# Altium project 2015Capstone.PrjPcb
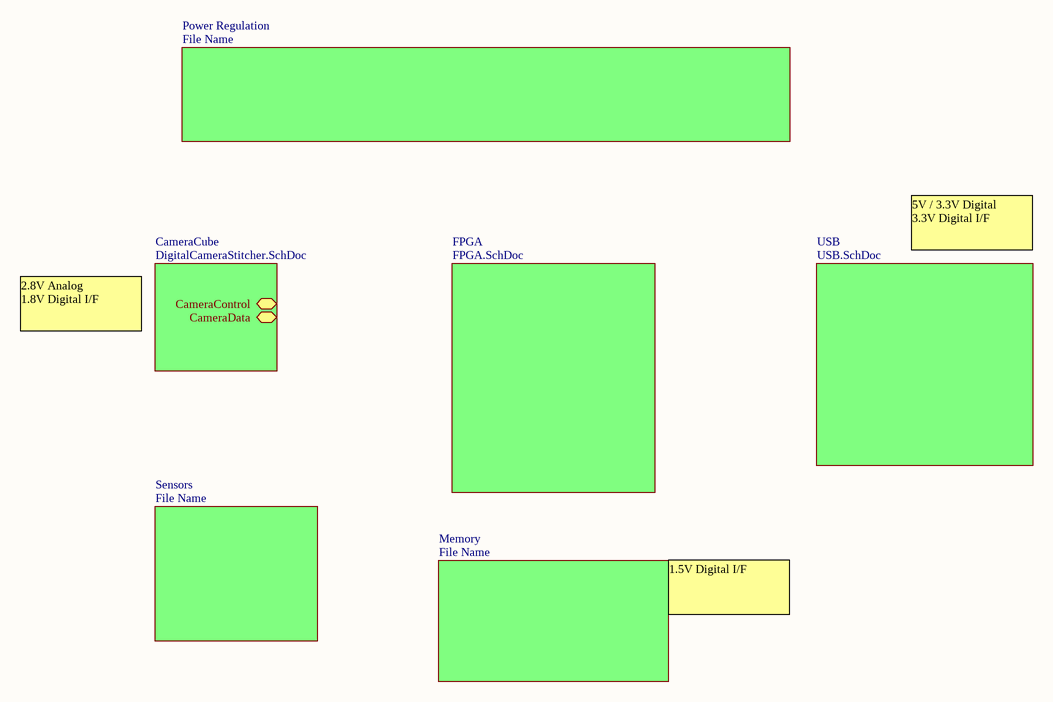
[diagram p0: Top.SchDoc]
7 sheets, 84 parts. Net scope: hierarchical (ports join the sheet entries above them; power ports are global).
Board file: DigitalCameraStitcher.PcbDoc
Sheets:
  Top.SchDoc
    FPGA = FPGA.SchDoc
      Power&Config = FPGA_Misc.SchDoc
      Bank 2 = FPGA_Bank2.SchDoc
      Bank 3 = FPGA_Bank3.SchDoc
    CameraCube = DigitalCameraStitcher.SchDoc
    USB = USB.SchDoc

## Sheet Top.SchDoc
size A

### Sub-sheets
CameraCube = DigitalCameraStitcher.SchDoc: CameraControl (harness CameraControlHarness), CameraData (harness CameraDataHarness)
FPGA = FPGA.SchDoc: no entries
Memory = File Name (file not in this document): no entries
Power Regulation = File Name (file not in this document): no entries
Sensors = File Name (file not in this document): no entries
USB = USB.SchDoc: no entries

### Notes on the sheet
- 5V / 3.3V Digital
  3.3V Digital I/F
- 2.8V Analog
  1.8V Digital I/F
- 1.5V Digital I/F

## Sheet FPGA.SchDoc
size C
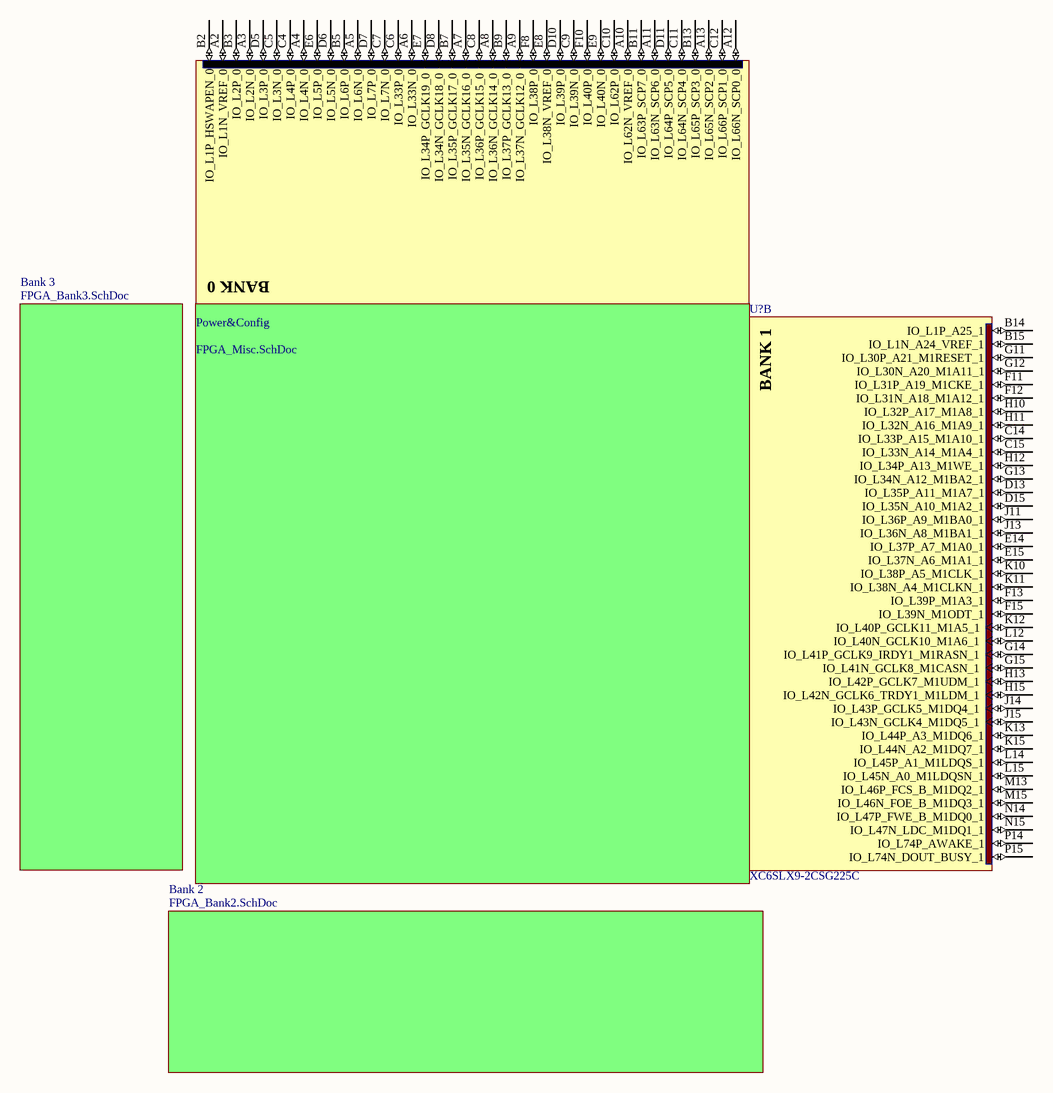
[diagram p1: FPGA.SchDoc]

### Parts
(Parts that share a designator on the sheet are numbered #1, #2 ... from top to bottom, then left to right.)
U?#1  XC6SLX9-2CSG225C  [CSG225]  (part A of 7)
U?#2  XC6SLX9-2CSG225C  [CSG225]  (part B of 7)

### Sub-sheets
Bank 2 = FPGA_Bank2.SchDoc: no entries
Bank 3 = FPGA_Bank3.SchDoc: no entries
Power&Config = FPGA_Misc.SchDoc: no entries

### Nets

Not connected (* = marked no-connect by the designer): U?#1 A2(IO_L1N_VREF_0) A3(IO_L2N_0) A4(IO_L4N_0) A5(IO_L6N_0) A6(IO_L33N_0) A7(IO_L35N_GCLK16_0) A8(IO_L36N_GCLK14_0) A9(IO_L37N_GCLK12_0) A10(IO_L62N_VREF_0) A11(IO_L63N_SCP6_0) A12(IO_L66N_SCP0_0) A13(IO_L65N_SCP2_0) B2(IO_L1P_HSWAPEN_0) B3(IO_L2P_0) B5(IO_L6P_0) B7(IO_L35P_GCLK17_0) B9(IO_L37P_GCLK13_0) B11(IO_L63P_SCP7_0) B13(IO_L65P_SCP3_0) C4(IO_L4P_0) C5(IO_L3N_0) C6(IO_L33P_0) C7(IO_L7N_0) C8(IO_L36P_GCLK15_0) C9(IO_L39N_0) C10(IO_L62P_0) C11(IO_L64N_SCP4_0) C12(IO_L66P_SCP1_0) D5(IO_L3P_0) D6(IO_L5N_0) D7(IO_L7P_0) D8(IO_L34N_GCLK18_0) D10(IO_L39P_0) D11(IO_L64P_SCP5_0) E6(IO_L5P_0) E7(IO_L34P_GCLK19_0) E8(IO_L38N_VREF_0) E9(IO_L40N_0) F8(IO_L38P_0) F10(IO_L40P_0); U?#2 B14(IO_L1P_A25_1) B15(IO_L1N_A24_VREF_1) C14(IO_L33P_A15_M1A10_1) C15(IO_L33N_A14_M1A4_1) D13(IO_L35P_A11_M1A7_1) D15(IO_L35N_A10_M1A2_1) E14(IO_L37P_A7_M1A0_1) E15(IO_L37N_A6_M1A1_1) F11(IO_L31P_A19_M1CKE_1) F12(IO_L31N_A18_M1A12_1) F13(IO_L39P_M1A3_1) F15(IO_L39N_M1ODT_1) G11(IO_L30P_A21_M1RESET_1) G12(IO_L30N_A20_M1A11_1) G13(IO_L34N_A12_M1BA2_1) G14(IO_L41P_GCLK9_IRDY1_M1RASN_1) G15(IO_L41N_GCLK8_M1CASN_1) H10(IO_L32P_A17_M1A8_1) H11(IO_L32N_A16_M1A9_1) H12(IO_L34P_A13_M1WE_1) H13(IO_L42P_GCLK7_M1UDM_1) H15(IO_L42N_GCLK6_TRDY1_M1LDM_1) J11(IO_L36P_A9_M1BA0_1) J13(IO_L36N_A8_M1BA1_1) J14(IO_L43P_GCLK5_M1DQ4_1) J15(IO_L43N_GCLK4_M1DQ5_1) K10(IO_L38P_A5_M1CLK_1) K11(IO_L38N_A4_M1CLKN_1) K12(IO_L40P_GCLK11_M1A5_1) K13(IO_L44P_A3_M1DQ6_1) K15(IO_L44N_A2_M1DQ7_1) L12(IO_L40N_GCLK10_M1A6_1) L14(IO_L45P_A1_M1LDQS_1) L15(IO_L45N_A0_M1LDQSN_1) M13(IO_L46P_FCS_B_M1DQ2_1) M15(IO_L46N_FOE_B_M1DQ3_1) N14(IO_L47P_FWE_B_M1DQ0_1) N15(IO_L47N_LDC_M1DQ1_1) P14(IO_L74P_AWAKE_1) P15(IO_L74N_DOUT_BUSY_1)

### Notes on the sheet
- (in symbol XC6SLX9-2CSG225C, part A) BANK 0
- (in symbol XC6SLX9-2CSG225C, part B) BANK 1

### Library data of the parts
U?#1 U?#2 = XC6SLX9-2CSG225C: Spartan-6 LX 1.2V FPGA, 160 User I/Os, 225-Ball Chip-Scale BGA (0.8mm Pitch), Speed Grade 2, Commercial Grade, Pb-Free; DatasheetVersion: ver1.6, Nov-2010; PackageVersion: ver1.1, Nov-2009; PackageReference: CSG225; PackageDescription: 225-Ball Chip-Scale BGA (CSG225) Package, 0.8 mm Pitch; Code_JEDEC: MO-275-HHAC-1; ComponentLink1Description: Manufacturer URL; ComponentLink1URL: http://www.xilinx.com/; ComponentLink2Description: Spartan-6 Datasheet; ComponentLink2URL: http://www.xilinx.com/support/documentation/data_sheets/ds160.pdf; ComponentLink3Description: Spartan-6 Documents; ComponentLink3URL: http://www.xilinx.com/support/documentation/spartan-6.htm

## Sheet FPGA_Misc.SchDoc
size B
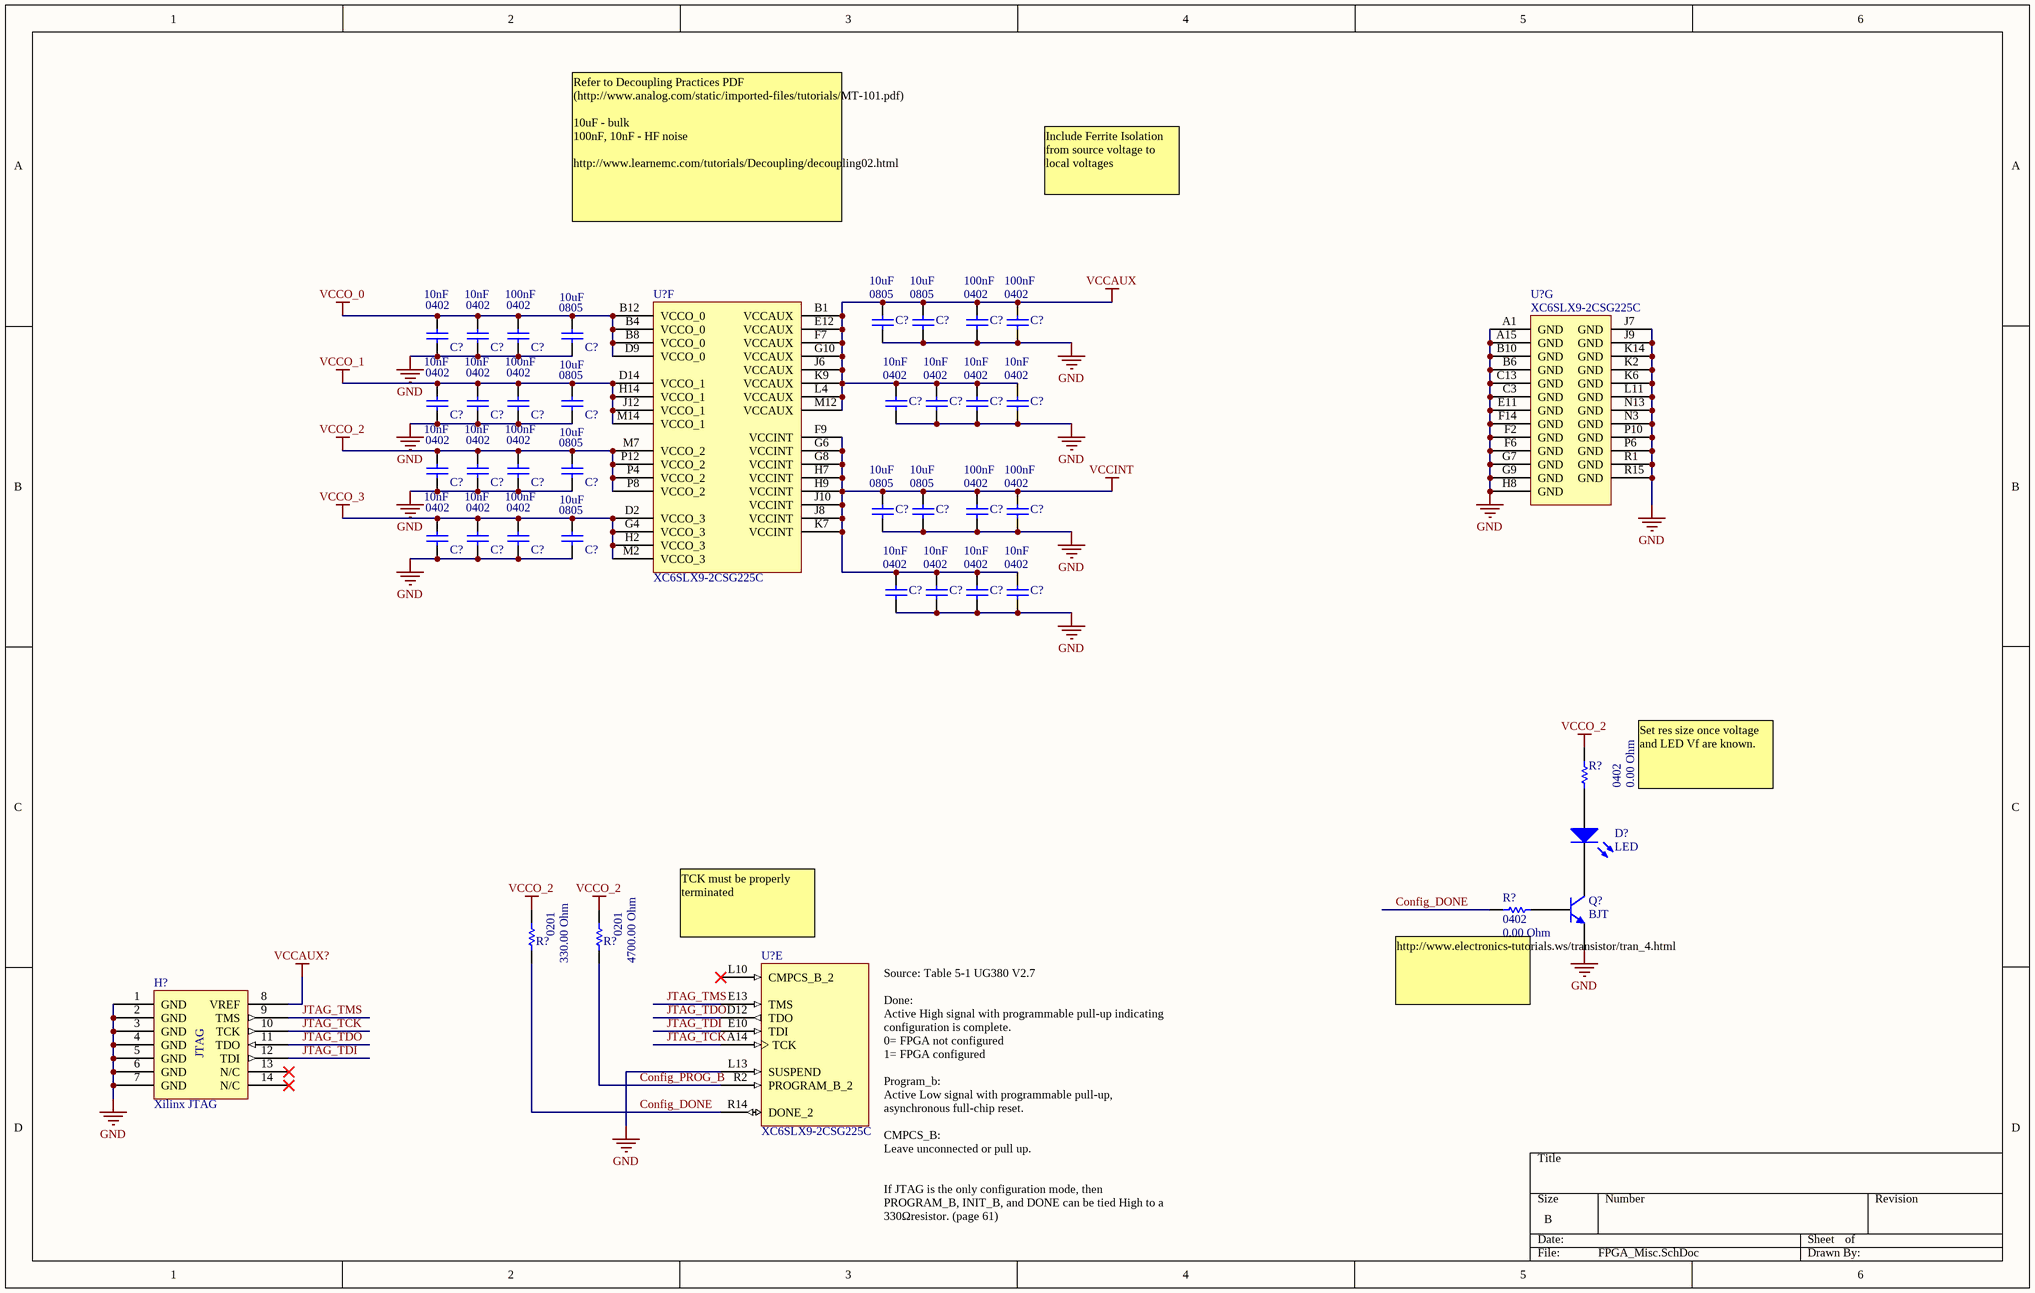
[diagram p2: FPGA_Misc.SchDoc]

### Parts
(Parts that share a designator on the sheet are numbered #1, #2 ... from top to bottom, then left to right.)
C?#1  value 10uF  Case-EIA: 0805  [CAPC0805(2012)145_L]  (hidden comment: CAP 10uF 6.3V 0805(2012))
C?#2  value 10uF  Case-EIA: 0805  [CAPC0805(2012)145_L]  (hidden comment: CAP 10uF 6.3V 0805(2012))
C?#3  value 100nF  Case-EIA: 0402  [CAPC0402(1005)60_M]  (hidden comment: CAP 100nF 10V 0402(1005))
C?#4  value 100nF  Case-EIA: 0402  [CAPC0402(1005)60_M]  (hidden comment: CAP 100nF 10V 0402(1005))
C?#5  value 10nF  Case-EIA: 0402  [CAPC0402(1005)60_M]  (hidden comment: CAP 10nF 10V 0402(1005))
C?#6  value 10nF  Case-EIA: 0402  [CAPC0402(1005)60_M]  (hidden comment: CAP 10nF 10V 0402(1005))
C?#7  value 100nF  Case-EIA: 0402  [CAPC0402(1005)60_M]  (hidden comment: CAP 100nF 10V 0402(1005))
C?#8  value 10uF  Case-EIA: 0805  [CAPC0805(2012)145_L]  (hidden comment: CAP 10uF 6.3V 0805(2012))
C?#9  value 10nF  Case-EIA: 0402  [CAPC0402(1005)60_M]  (hidden comment: CAP 10nF 10V 0402(1005))
C?#10  value 10nF  Case-EIA: 0402  [CAPC0402(1005)60_M]  (hidden comment: CAP 10nF 10V 0402(1005))
C?#11  value 100nF  Case-EIA: 0402  [CAPC0402(1005)60_M]  (hidden comment: CAP 100nF 10V 0402(1005))
C?#12  value 10uF  Case-EIA: 0805  [CAPC0805(2012)145_L]  (hidden comment: CAP 10uF 6.3V 0805(2012))
C?#13  value 10nF  Case-EIA: 0402  [CAPC0402(1005)60_M]  (hidden comment: CAP 10nF 10V 0402(1005))
C?#14  value 10nF  Case-EIA: 0402  [CAPC0402(1005)60_M]  (hidden comment: CAP 10nF 10V 0402(1005))
C?#15  value 10nF  Case-EIA: 0402  [CAPC0402(1005)60_M]  (hidden comment: CAP 10nF 10V 0402(1005))
C?#16  value 10nF  Case-EIA: 0402  [CAPC0402(1005)60_M]  (hidden comment: CAP 10nF 10V 0402(1005))
C?#17  value 10nF  Case-EIA: 0402  [CAPC0402(1005)60_M]  (hidden comment: CAP 10nF 10V 0402(1005))
C?#18  value 10nF  Case-EIA: 0402  [CAPC0402(1005)60_M]  (hidden comment: CAP 10nF 10V 0402(1005))
C?#19  value 100nF  Case-EIA: 0402  [CAPC0402(1005)60_M]  (hidden comment: CAP 100nF 10V 0402(1005))
C?#20  value 10uF  Case-EIA: 0805  [CAPC0805(2012)145_L]  (hidden comment: CAP 10uF 6.3V 0805(2012))
C?#21  value 10uF  Case-EIA: 0805  [CAPC0805(2012)145_L]  (hidden comment: CAP 10uF 6.3V 0805(2012))
C?#22  value 10uF  Case-EIA: 0805  [CAPC0805(2012)145_L]  (hidden comment: CAP 10uF 6.3V 0805(2012))
C?#23  value 100nF  Case-EIA: 0402  [CAPC0402(1005)60_M]  (hidden comment: CAP 100nF 10V 0402(1005))
C?#24  value 100nF  Case-EIA: 0402  [CAPC0402(1005)60_M]  (hidden comment: CAP 100nF 10V 0402(1005))
C?#25  value 10nF  Case-EIA: 0402  [CAPC0402(1005)60_M]  (hidden comment: CAP 10nF 10V 0402(1005))
C?#26  value 10nF  Case-EIA: 0402  [CAPC0402(1005)60_M]  (hidden comment: CAP 10nF 10V 0402(1005))
C?#27  value 100nF  Case-EIA: 0402  [CAPC0402(1005)60_M]  (hidden comment: CAP 100nF 10V 0402(1005))
C?#28  value 10uF  Case-EIA: 0805  [CAPC0805(2012)145_L]  (hidden comment: CAP 10uF 6.3V 0805(2012))
C?#29  value 10nF  Case-EIA: 0402  [CAPC0402(1005)60_M]  (hidden comment: CAP 10nF 10V 0402(1005))
C?#30  value 10nF  Case-EIA: 0402  [CAPC0402(1005)60_M]  (hidden comment: CAP 10nF 10V 0402(1005))
C?#31  value 10nF  Case-EIA: 0402  [CAPC0402(1005)60_M]  (hidden comment: CAP 10nF 10V 0402(1005))
C?#32  value 10nF  Case-EIA: 0402  [CAPC0402(1005)60_M]  (hidden comment: CAP 10nF 10V 0402(1005))
D?  LED
H?  Xilinx JTAG
Q?  BJT
R?#1  value 0.00 Ohm  Case-EIA: 0402  [RESC0402(1005)_N]  (hidden comment: Jumper 0402(1005))
R?#2  value 0.00 Ohm  Case-EIA: 0402  [RESC0402(1005)_N]  (hidden comment: Jumper 0402(1005))
R?#3  value 330.00 Ohm  Case-EIA: 0201  [RESC0201(0603)_M]  (hidden comment: 330R 1% 0201(0603))
R?#4  value 4700.00 Ohm  Case-EIA: 0201  [RESC0201(0603)_M]  (hidden comment: 4K7 1% 0201(0603))
U?#3  XC6SLX9-2CSG225C  [CSG225]  (part F of 7)
U?#4  XC6SLX9-2CSG225C  [CSG225]  (part G of 7)
U?#5  XC6SLX9-2CSG225C  [CSG225]  (part E of 7)

### Nets
GND: C?#1.1 C?#2.1 C?#3.1 C?#4.1 C?#5.1 C?#6.1 C?#7.1 C?#8.1 C?#9.1 C?#10.1 C?#11.1 C?#12.1 C?#13.1 C?#14.1 C?#15.1 C?#16.1 C?#17.1 C?#18.1 C?#19.1 C?#20.1 C?#21.1 C?#22.1 C?#23.1 C?#24.1 C?#25.1 C?#26.1 C?#27.1 C?#28.1 C?#29.1 C?#30.1 C?#31.1 C?#32.1 H?.1(GND) H?.2(GND) H?.3(GND) H?.4(GND) H?.5(GND) H?.6(GND) H?.7(GND) Q?.1(E) U?#4.A1(GND) U?#4.A15(GND) U?#4.B6(GND) U?#4.B10(GND) U?#4.C3(GND) U?#4.C13(GND) U?#4.E11(GND) U?#4.F2(GND) U?#4.F6(GND) U?#4.F14(GND) U?#4.G7(GND) U?#4.G9(GND) U?#4.H8(GND) U?#4.J7(GND) U?#4.J9(GND) U?#4.K2(GND) U?#4.K6(GND) U?#4.K14(GND) U?#4.L11(GND) U?#4.N3(GND) U?#4.N13(GND) U?#4.P6(GND) U?#4.P10(GND) U?#4.R1(GND) U?#4.R15(GND) U?#5.L13(SUSPEND)
VCCAUX: C?#1.2 C?#2.2 C?#3.2 C?#4.2 C?#13.2 C?#14.2 C?#15.2 C?#16.2 U?#3.B1(VCCAUX) U?#3.E12(VCCAUX) U?#3.F7(VCCAUX) U?#3.G10(VCCAUX) U?#3.J6(VCCAUX) U?#3.K9(VCCAUX) U?#3.L4(VCCAUX) U?#3.M12(VCCAUX)
VCCAUX?: H?.8(VREF)
VCCINT: C?#21.2 C?#22.2 C?#23.2 C?#24.2 C?#29.2 C?#30.2 C?#31.2 C?#32.2 U?#3.F9(VCCINT) U?#3.G6(VCCINT) U?#3.G8(VCCINT) U?#3.H7(VCCINT) U?#3.H9(VCCINT) U?#3.J8(VCCINT) U?#3.J10(VCCINT) U?#3.K7(VCCINT)
VCCO_0: C?#5.2 C?#6.2 C?#7.2 C?#8.2 U?#3.B4(VCCO_0) U?#3.B8(VCCO_0) U?#3.B12(VCCO_0) U?#3.D9(VCCO_0)
VCCO_1: C?#9.2 C?#10.2 C?#11.2 C?#12.2 U?#3.D14(VCCO_1) U?#3.H14(VCCO_1) U?#3.J12(VCCO_1) U?#3.M14(VCCO_1)
VCCO_2: C?#17.2 C?#18.2 C?#19.2 C?#20.2 R?#1.2 R?#3.2 R?#4.2 U?#3.M7(VCCO_2) U?#3.P4(VCCO_2) U?#3.P8(VCCO_2) U?#3.P12(VCCO_2)
VCCO_3: C?#25.2 C?#26.2 C?#27.2 C?#28.2 U?#3.D2(VCCO_3) U?#3.G4(VCCO_3) U?#3.H2(VCCO_3) U?#3.M2(VCCO_3)
Config_DONE: R?#2.2 R?#3.1 U?#5.R14(DONE_2)
Config_PROG_B: R?#4.1 U?#5.R2(PROGRAM_B_2)
JTAG_TCK: H?.10(TCK) U?#5.A14(TCK)
JTAG_TDI: H?.12(TDI) U?#5.E10(TDI)
JTAG_TDO: H?.11(TDO) U?#5.D12(TDO)
JTAG_TMS: H?.9(TMS) U?#5.E13(TMS)
NetD?_1: D?.1(A) R?#1.1
NetD?_2: D?.2(K) Q?.3(C)
NetQ?_2: Q?.2(B) R?#2.1

Not connected (* = marked no-connect by the designer): H? 13(N/C)* 14(N/C)*; U?#5 L10(CMPCS_B_2)*

### Notes on the sheet
- Refer to Decoupling Practices PDF (http://www.analog.com/static/imported-files/tutorials/MT-101.pdf)
  10uF - bulk
  100nF, 10nF - HF noise
  http://www.learnemc.com/tutorials/Decoupling/decoupling02.html
- Include Ferrite Isolation from source voltage to local voltages
- Set res size once voltage and LED Vf are known.
- (near U?#5) TCK must be properly terminated
- http://www.electronics-tutorials.ws/transistor/tran_4.html
- Source: Table 5-1 UG380 V2.7
  Done:
  Active High signal with programmable pull-up indicating configuration is complete.
  0= FPGA not configured
  1= FPGA configured
  Program_b:
  Active Low signal with programmable pull-up, asynchronous full-chip reset.
  CMPCS_B:
  Leave unconnected or pull up.
  If JTAG is the only configuration mode, then PROGRAM_B, INIT_B, and DONE can be tied High to a 330Ωresistor. (page 61)
- (in symbol Xilinx JTAG Header) JTAG

### Library data of the parts
C?#1 C?#2 C?#8 C?#12 C?#20-C?#22 C?#28 = CMP-1036-04915-1: CAP 10uF 6.3V ±10% 0805 (2012 Metric) Thickness 1.45mm SMD; Case-Metric: 2012; Technology: SMT; Tolerance: ±10%; Rated Voltage: 6.3 V; Max Thickness: 1.45 mm
C?#3 C?#4 C?#7 C?#11 C?#19 C?#23 C?#24 C?#27 = CMP-1034-02065-1: CAP 100nF 10V ±10% 0402 (1005 Metric) Thickness 0.6mm SMD; Case-Metric: 1005; Max Thickness: 0.6 mm; Tolerance: ±10%; Rated Voltage: 10 V; Technology: SMT
C?#5 C?#6 C?#9 C?#10 C?#13-C?#18 C?#25 C?#26 C?#29-C?#32 = CMP-1034-01871-1: CAP 10nF 10V ±10% 0402 (1005 Metric) Thickness 0.6mm SMD; Case-Metric: 1005; Rated Voltage: 10 V; Technology: SMT; Max Thickness: 0.6 mm; Tolerance: ±10%
D? = LED: SMT LED
H? = Xilinx JTAG Header
Q? = BJT: NPN General Purpose Amplifier
R?#1 R?#2 = CMP-1011-00001-1: Jumper 0402 (1005 Metric); Tolerance: None; Case-Metric: 1005; Power: None; Technology: SMT
R?#3 = CMP-1010-00360-1: 330R 0.05W 1% 0201 (0603 Metric)  SMD; Case-Metric: 0603; Power: 0.05 W; Tolerance: 1 %; Technology: SMT
R?#4 = CMP-1010-00492-1: 4K7 0.05W 1% 0201 (0603 Metric)  SMD; Case-Metric: 0603; Technology: SMT; Tolerance: 1 %; Power: 0.05 W
U?#3-U?#5 = XC6SLX9-2CSG225C: as U?#1 on sheet FPGA; DatasheetVersion: ver1.6, Nov-2010; PackageVersion: ver1.1, Nov-2009; PackageReference: CSG225; PackageDescription: 225-Ball Chip-Scale BGA (CSG225) Package, 0.8 mm Pitch; Code_JEDEC: MO-275-HHAC-1; ComponentLink1Description: Manufacturer URL; ComponentLink1URL: http://www.xilinx.com/; ComponentLink2Description: Spartan-6 Datasheet; ComponentLink2URL: http://www.xilinx.com/support/documentation/data_sheets/ds160.pdf; ComponentLink3Description: Spartan-6 Documents; ComponentLink3URL: http://www.xilinx.com/support/documentation/spartan-6.htm

## Sheet FPGA_Bank2.SchDoc
size B
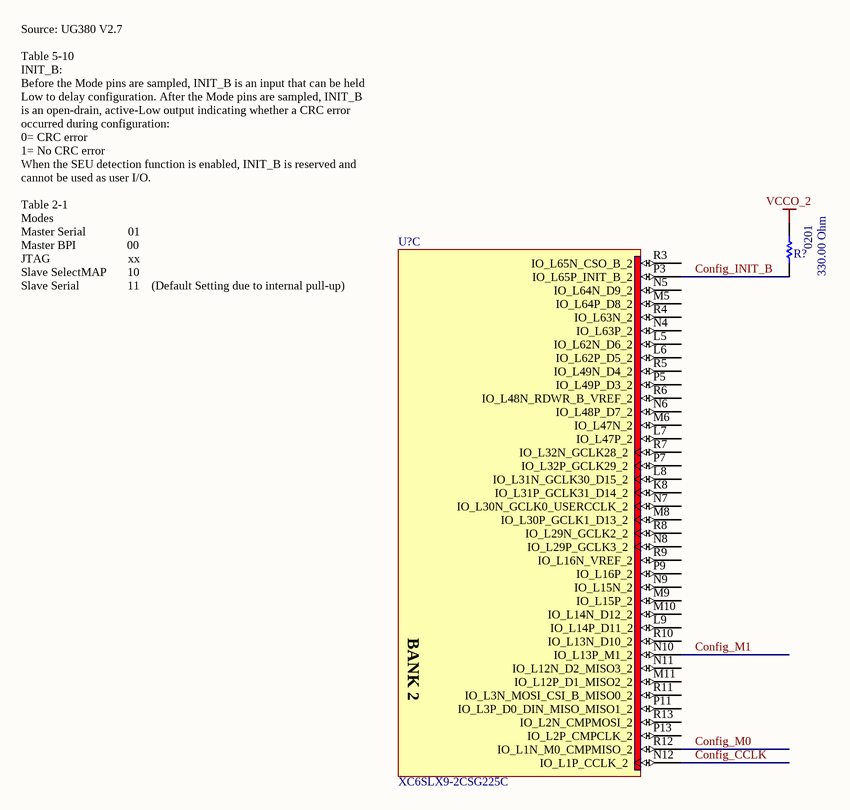
[diagram p3: FPGA_Bank2.SchDoc]

### Parts
(Parts that share a designator on the sheet are numbered #1, #2 ... from top to bottom, then left to right.)
R?#5  value 330.00 Ohm  Case-EIA: 0201  [RESC0201(0603)_M]  (hidden comment: 330R 1% 0201(0603))
U?#6  XC6SLX9-2CSG225C  [CSG225]  (part C of 7)

### Nets
VCCO_2: R?#5.2
Config_CCLK: U?#6.N12(IO_L1P_CCLK_2)
Config_INIT_B: R?#5.1 U?#6.P3(IO_L65P_INIT_B_2)
Config_M0: U?#6.R12(IO_L1N_M0_CMPMISO_2)
Config_M1: U?#6.N10(IO_L13P_M1_2)

Not connected (* = marked no-connect by the designer): U?#6 K8(IO_L31P_GCLK31_D14_2) L5(IO_L62N_D6_2) L6(IO_L62P_D5_2) L7(IO_L47P_2) L8(IO_L31N_GCLK30_D15_2) L9(IO_L14P_D11_2) M5(IO_L64P_D8_2) M6(IO_L47N_2) M8(IO_L30P_GCLK1_D13_2) M9(IO_L15P_2) M10(IO_L14N_D12_2) M11(IO_L12P_D1_MISO2_2) N4(IO_L63P_2) N5(IO_L64N_D9_2) N6(IO_L48P_D7_2) N7(IO_L30N_GCLK0_USERCCLK_2) N8(IO_L29P_GCLK3_2) N9(IO_L15N_2) N11(IO_L12N_D2_MISO3_2) P5(IO_L49P_D3_2) P7(IO_L32P_GCLK29_2) P9(IO_L16P_2) P11(IO_L3P_D0_DIN_MISO_MISO1_2) P13(IO_L2P_CMPCLK_2) R3(IO_L65N_CSO_B_2) R4(IO_L63N_2) R5(IO_L49N_D4_2) R6(IO_L48N_RDWR_B_VREF_2) R7(IO_L32N_GCLK28_2) R8(IO_L29N_GCLK2_2) R9(IO_L16N_VREF_2) R10(IO_L13N_D10_2) R11(IO_L3N_MOSI_CSI_B_MISO0_2) R13(IO_L2N_CMPMOSI_2)

### Notes on the sheet
- Source: UG380 V2.7
  Table 5-10
  INIT_B:
  Before the Mode pins are sampled, INIT_B is an input that can be held
  Low to delay configuration. After the Mode pins are sampled, INIT_B
  is an open-drain, active-Low output indicating whether a CRC error
  occurred during configuration:
  0= CRC error
  1= No CRC error
  When the SEU detection function is enabled, INIT_B is reserved and
  cannot be used as user I/O.
  Table 2-1
  Modes
  Master Serial              01
  Master BPI                 00
  JTAG                          xx
  Slave SelectMAP       10
  Slave Serial                11    (Default Setting due to internal pull-up)
- (in symbol XC6SLX9-2CSG225C, part C) BANK 2

### Library data of the parts
R?#5 = CMP-1010-00360-1: as R?#3 on sheet FPGA_Misc; Power: 0.05 W; Tolerance: 1 %; Technology: SMT
U?#6 = XC6SLX9-2CSG225C: as U?#1 on sheet FPGA; DatasheetVersion: ver1.6, Nov-2010; PackageVersion: ver1.1, Nov-2009; PackageReference: CSG225; PackageDescription: 225-Ball Chip-Scale BGA (CSG225) Package, 0.8 mm Pitch; Code_JEDEC: MO-275-HHAC-1; ComponentLink1Description: Manufacturer URL; ComponentLink1URL: http://www.xilinx.com/; ComponentLink2Description: Spartan-6 Datasheet; ComponentLink2URL: http://www.xilinx.com/support/documentation/data_sheets/ds160.pdf; ComponentLink3Description: Spartan-6 Documents; ComponentLink3URL: http://www.xilinx.com/support/documentation/spartan-6.htm

## Sheet FPGA_Bank3.SchDoc
size B
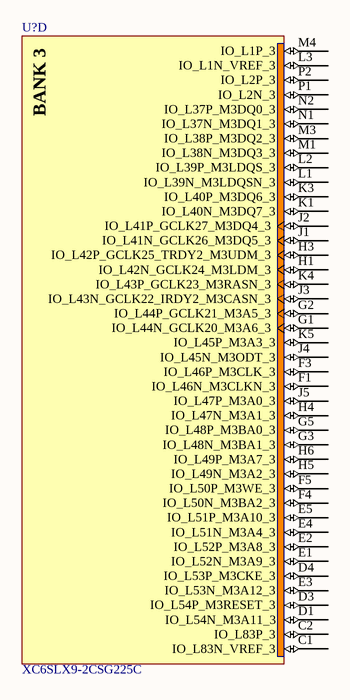
[diagram p4: FPGA_Bank3.SchDoc]

### Parts
(Parts that share a designator on the sheet are numbered #1, #2 ... from top to bottom, then left to right.)
U?#7  XC6SLX9-2CSG225C  [CSG225]  (part D of 7)

### Nets

Not connected (* = marked no-connect by the designer): U?#7 C1(IO_L83N_VREF_3) C2(IO_L83P_3) D1(IO_L54N_M3A11_3) D3(IO_L54P_M3RESET_3) D4(IO_L53P_M3CKE_3) E1(IO_L52N_M3A9_3) E2(IO_L52P_M3A8_3) E3(IO_L53N_M3A12_3) E4(IO_L51N_M3A4_3) E5(IO_L51P_M3A10_3) F1(IO_L46N_M3CLKN_3) F3(IO_L46P_M3CLK_3) F4(IO_L50N_M3BA2_3) F5(IO_L50P_M3WE_3) G1(IO_L44N_GCLK20_M3A6_3) G2(IO_L44P_GCLK21_M3A5_3) G3(IO_L48N_M3BA1_3) G5(IO_L48P_M3BA0_3) H1(IO_L42N_GCLK24_M3LDM_3) H3(IO_L42P_GCLK25_TRDY2_M3UDM_3) H4(IO_L47N_M3A1_3) H5(IO_L49N_M3A2_3) H6(IO_L49P_M3A7_3) J1(IO_L41N_GCLK26_M3DQ5_3) J2(IO_L41P_GCLK27_M3DQ4_3) J3(IO_L43N_GCLK22_IRDY2_M3CASN_3) J4(IO_L45N_M3ODT_3) J5(IO_L47P_M3A0_3) K1(IO_L40N_M3DQ7_3) K3(IO_L40P_M3DQ6_3) K4(IO_L43P_GCLK23_M3RASN_3) K5(IO_L45P_M3A3_3) L1(IO_L39N_M3LDQSN_3) L2(IO_L39P_M3LDQS_3) L3(IO_L1N_VREF_3) M1(IO_L38N_M3DQ3_3) M3(IO_L38P_M3DQ2_3) M4(IO_L1P_3) N1(IO_L37N_M3DQ1_3) N2(IO_L37P_M3DQ0_3) P1(IO_L2N_3) P2(IO_L2P_3)

### Notes on the sheet
- (in symbol XC6SLX9-2CSG225C, part D) BANK 3

### Library data of the parts
U?#7 = XC6SLX9-2CSG225C: as U?#1 on sheet FPGA; DatasheetVersion: ver1.6, Nov-2010; PackageVersion: ver1.1, Nov-2009; PackageReference: CSG225; PackageDescription: 225-Ball Chip-Scale BGA (CSG225) Package, 0.8 mm Pitch; Code_JEDEC: MO-275-HHAC-1; ComponentLink1Description: Manufacturer URL; ComponentLink1URL: http://www.xilinx.com/; ComponentLink2Description: Spartan-6 Datasheet; ComponentLink2URL: http://www.xilinx.com/support/documentation/data_sheets/ds160.pdf; ComponentLink3Description: Spartan-6 Documents; ComponentLink3URL: http://www.xilinx.com/support/documentation/spartan-6.htm

## Sheet DigitalCameraStitcher.SchDoc: CameraCube
size A; Revision: 1
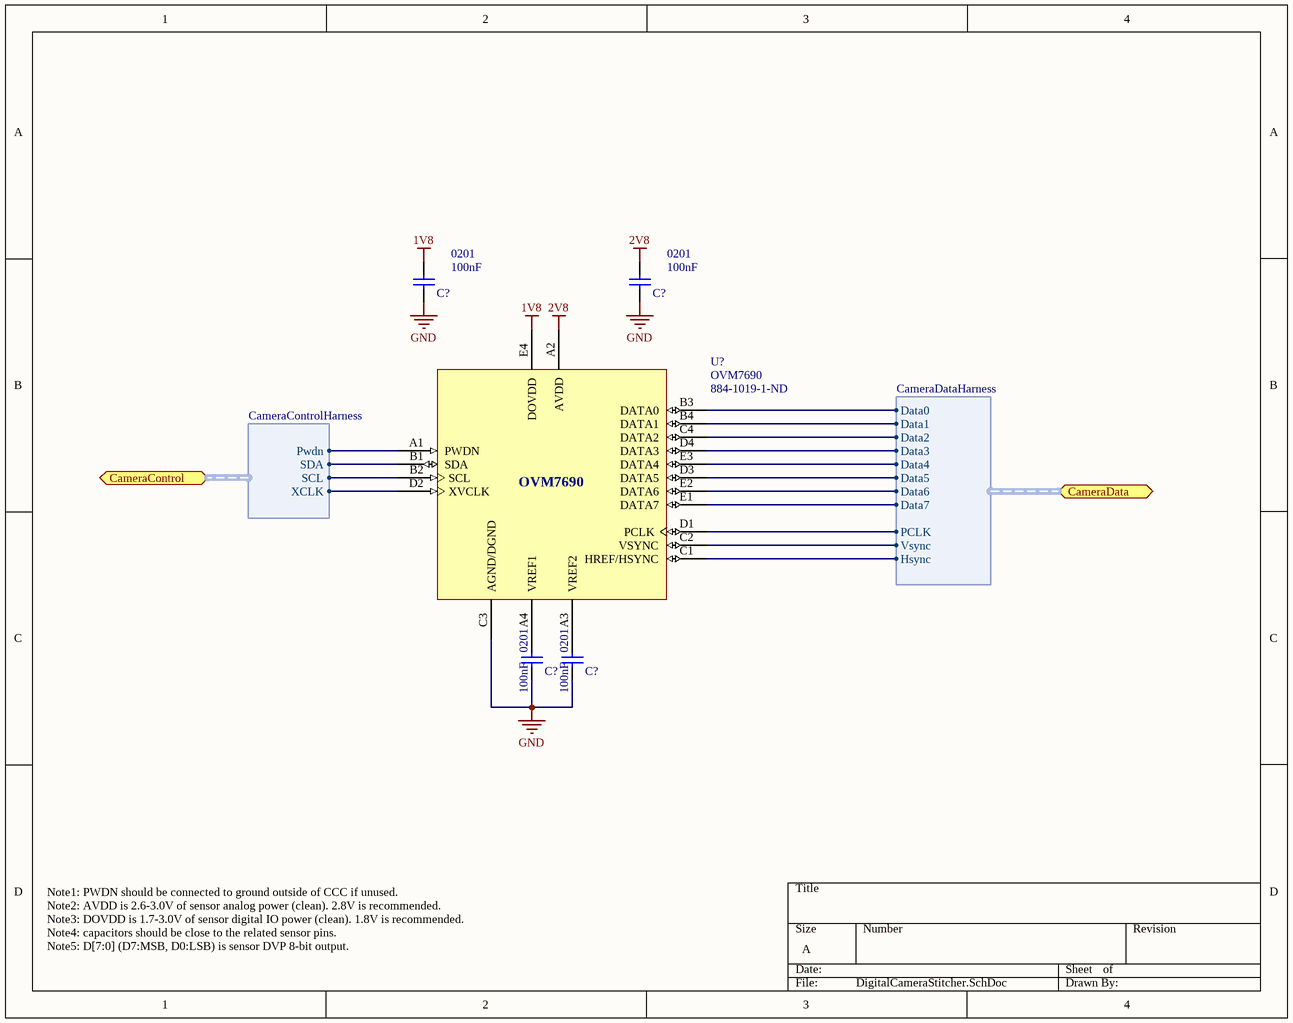
[diagram p5: DigitalCameraStitcher.SchDoc]

### Parts
(Parts that share a designator on the sheet are numbered #1, #2 ... from top to bottom, then left to right.)
C?#33  value 100nF  Case-EIA: 0201  [CAPC0201(0603)33_M]  (hidden comment: CAP 100nF 4V 0201(0603))
C?#34  value 100nF  Case-EIA: 0201  [CAPC0201(0603)33_M]  (hidden comment: CAP 100nF 4V 0201(0603))
C?#35  value 100nF  Case-EIA: 0201  [CAPC0201(0603)33_M]  (hidden comment: CAP 100nF 4V 0201(0603))
C?#36  value 100nF  Case-EIA: 0201  [CAPC0201(0603)33_M]  (hidden comment: CAP 100nF 4V 0201(0603))
U?#8  OVM7690  Supplier Part Number 1: 884-1019-1-ND  [OVM7690]

### Ports
CameraControl (harness CameraControlHarness), CameraData (harness CameraDataHarness)

### Harnesses
CameraDataHarness: Data0, Data1, Data2, Data3, Data4, Data5, Data6, Data7, PCLK, Vsync, Hsync
CameraControlHarness: SDA, SCL, XCLK, Pwdn

### Nets
1V8: C?#33.1 U?#8.E4(DOVDD)
2V8: C?#34.1 U?#8.A2(AVDD)
GND: C?#33.2 C?#34.2 C?#35.2 C?#36.2 U?#8.C3(AGND/DGND)
NetC?#35_1: C?#35.1 U?#8.A4(VREF1)
NetC?#36_1: C?#36.1 U?#8.A3(VREF2)
NetU?#8_A1: U?#8.A1(PWDN) ; port CameraControl.Pwdn
NetU?#8_B1: U?#8.B1(SDA) ; port CameraControl.SDA
NetU?#8_B2: U?#8.B2(SCL) ; port CameraControl.SCL
NetU?#8_B3: U?#8.B3(DATA0) ; port CameraData.Data0
NetU?#8_B4: U?#8.B4(DATA1) ; port CameraData.Data1
NetU?#8_C1: U?#8.C1(HREF/HSYNC) ; port CameraData.Hsync
NetU?#8_C2: U?#8.C2(VSYNC) ; port CameraData.Vsync
NetU?#8_C4: U?#8.C4(DATA2) ; port CameraData.Data2
NetU?#8_D1: U?#8.D1(PCLK) ; port CameraData.PCLK
NetU?#8_D2: U?#8.D2(XVCLK) ; port CameraControl.XCLK
NetU?#8_D3: U?#8.D3(DATA5) ; port CameraData.Data5
NetU?#8_D4: U?#8.D4(DATA3) ; port CameraData.Data3
NetU?#8_E1: U?#8.E1(DATA7) ; port CameraData.Data7
NetU?#8_E2: U?#8.E2(DATA6) ; port CameraData.Data6
NetU?#8_E3: U?#8.E3(DATA4) ; port CameraData.Data4

### Notes on the sheet
- Note1: PWDN should be connected to ground outside of CCC if unused.
  Note2: AVDD is 2.6-3.0V of sensor analog power (clean). 2.8V is recommended.
  Note3: DOVDD is 1.7-3.0V of sensor digital IO power (clean). 1.8V is recommended.
  Note4: capacitors should be close to the related sensor pins.
  Note5: D[7:0] (D7:MSB, D0:LSB) is sensor DVP 8-bit output.

### Library data of the parts
C?#33-C?#36 = CMP-1033-00657-1: CAP 100nF 4V ±10% 0201 (0603 Metric) Thickness 0.33mm SMD; Case-Metric: 0603; Technology: SMT; Max Thickness: 0.33 mm; Tolerance: ±10%; Rated Voltage: 4 V
U?#8 = OVM7690: Supplier 1: Digi-Key

## Sheet USB.SchDoc
size B
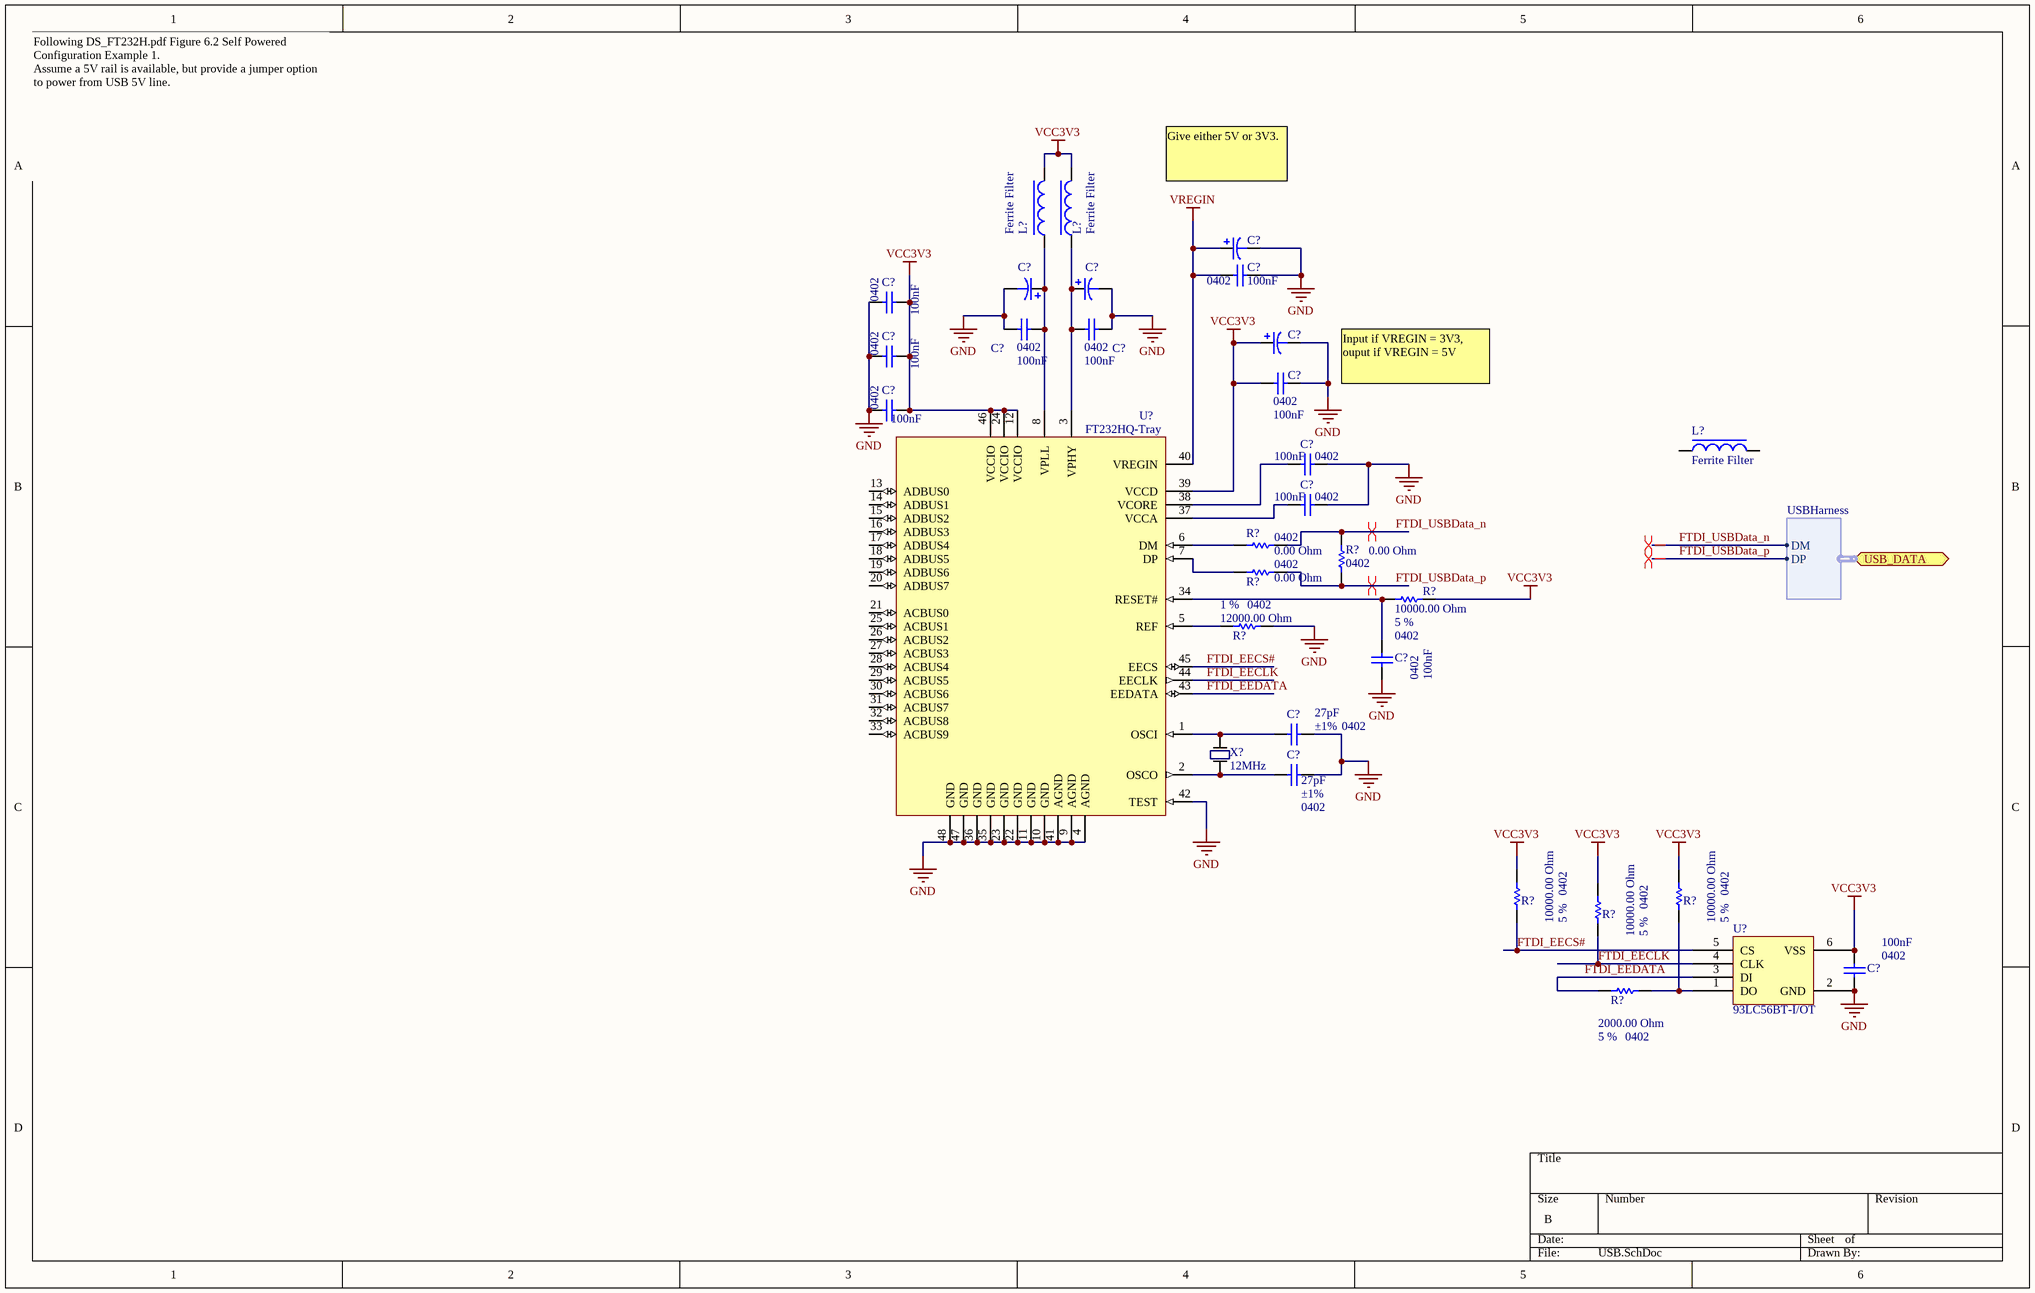
[diagram p6: USB.SchDoc]

### Parts
(Parts that share a designator on the sheet are numbered #1, #2 ... from top to bottom, then left to right.)
C?#37  Cap Pol  (value not drawn)
C?#38  value 100nF  Case-EIA: 0402  [CAPC0402(1005)60_M]  (hidden comment: CAP 100nF 10V 0402(1005))
C?#39  value 100nF  Case-EIA: 0402  [CAPC0402(1005)60_M]  (hidden comment: CAP 100nF 10V 0402(1005))
C?#40  Cap Pol  (value not drawn)
C?#41  Cap Pol  (value not drawn)
C?#42  value 100nF  Case-EIA: 0402  [CAPC0402(1005)60_M]  (hidden comment: CAP 100nF 10V 0402(1005))
C?#43  value 100nF  Case-EIA: 0402  [CAPC0402(1005)60_M]  (hidden comment: CAP 100nF 10V 0402(1005))
C?#44  value 100nF  Case-EIA: 0402  [CAPC0402(1005)60_M]  (hidden comment: CAP 100nF 10V 0402(1005))
C?#45  Cap Pol  (value not drawn)
C?#46  value 100nF  Case-EIA: 0402  [CAPC0402(1005)60_M]  (hidden comment: CAP 100nF 10V 0402(1005))
C?#47  value 100nF  Case-EIA: 0402  [CAPC0402(1005)60_M]  (hidden comment: CAP 100nF 10V 0402(1005))
C?#48  value 100nF  Case-EIA: 0402  [CAPC0402(1005)60_M]  (hidden comment: CAP 100nF 10V 0402(1005))
C?#49  value 100nF  Case-EIA: 0402  [CAPC0402(1005)60_M]  (hidden comment: CAP 100nF 10V 0402(1005))
C?#50  value 100nF  Case-EIA: 0402  [CAPC0402(1005)60_M]  (hidden comment: CAP 100nF 10V 0402(1005))
C?#51  value 27pF  Case-EIA: 0402  Tolerance: ±1%  [CAPC0402(1005)60_M]  (hidden comment: CAP 27pF 10V 0402(1005))
C?#52  value 27pF  Case-EIA: 0402  Tolerance: ±1%  [CAPC0402(1005)60_M]  (hidden comment: CAP 27pF 10V 0402(1005))
C?#53  value 100nF  Case-EIA: 0402  [CAPC0402(1005)60_M]  (hidden comment: CAP 100nF 10V 0402(1005))
L?#1  Ferrite Filter
L?#2  Ferrite Filter
L?#3  Ferrite Filter
R?#6  value 0.00 Ohm  Case-EIA: 0402  [RESC0402(1005)_N]  (hidden comment: Jumper 0402(1005))
R?#7  value 0.00 Ohm  Case-EIA: 0402  [RESC0402(1005)_N]  (hidden comment: Jumper 0402(1005))
R?#8  value 0.00 Ohm  Case-EIA: 0402  [RESC0402(1005)_N]  (hidden comment: Jumper 0402(1005))
R?#9  value 10000.00 Ohm  Tolerance: 5 %  Case-EIA: 0402  [RESC0402(1005)_N]  (hidden comment: 10K 5% 0402(1005))
R?#10  value 12000.00 Ohm  Tolerance: 1 %  Case-EIA: 0402  [RESC0402(1005)_N]  (hidden comment: 12K 1% 0402(1005))
R?#11  value 10000.00 Ohm  Tolerance: 5 %  Case-EIA: 0402  [RESC0402(1005)_N]  (hidden comment: 10K 5% 0402(1005))
R?#12  value 10000.00 Ohm  Tolerance: 5 %  Case-EIA: 0402  [RESC0402(1005)_N]  (hidden comment: 10K 5% 0402(1005))
R?#13  value 10000.00 Ohm  Tolerance: 5 %  Case-EIA: 0402  [RESC0402(1005)_N]  (hidden comment: 10K 5% 0402(1005))
R?#14  value 2000.00 Ohm  Case-EIA: 0402  Tolerance: 5 %  [RESC0402(1005)_N]  (hidden comment: 2K 5% 0402(1005))
U?#9  FT232HQ-Tray  [QFN48_N]
U?#10  93LC56BT-I/OT
X?  12MHz

### Ports
USB_DATA (harness USBHarness)

### Harnesses
USBHarness: DM, DP

### Nets
GND: C?#37.2 C?#38.1 C?#39.2 C?#40.2 C?#41.2 C?#42.1 C?#43.2 C?#44.1 C?#45.2 C?#46.1 C?#47.2 C?#48.1 C?#49.2 C?#50.1 C?#51.2 C?#52.1 C?#53.1 R?#10.1 U?#9.4(AGND) U?#9.9(AGND) U?#9.10(GND) U?#9.11(GND) U?#9.22(GND) U?#9.23(GND) U?#9.35(GND) U?#9.36(GND) U?#9.41(AGND) U?#9.42(TEST) U?#9.47(GND) U?#9.48(GND) U?#10.2(GND)
VCC3V3: C?#39.1 C?#43.1 C?#45.1 C?#46.2 C?#47.1 C?#53.2 L?#1.2 L?#2.2 R?#9.1 R?#11.2 R?#12.2 R?#13.2 U?#9.12(VCCIO) U?#9.24(VCCIO) U?#9.39(VCCD) U?#9.46(VCCIO) U?#10.6(VSS)
VREGIN: C?#37.1 C?#38.2 U?#9.40(VREGIN)
FTDI_EECLK: R?#13.1 U?#9.44(EECLK) U?#10.4(CLK)
FTDI_EECS#: R?#11.1 U?#9.45(EECS) U?#10.5(CS)
FTDI_EEDATA: R?#14.1 U?#9.43(EEDATA) U?#10.3(DI)
FTDI_USBData_n: R?#6.2 R?#8.2 ; port USB_DATA.DM
FTDI_USBData_p: R?#7.2 R?#8.1 ; port USB_DATA.DP
NetC?#40_1: C?#40.1 C?#44.2 L?#1.1 U?#9.8(VPLL)
NetC?#41_1: C?#41.1 C?#42.2 L?#2.1 U?#9.3(VPHY)
NetC?#48_2: C?#48.2 U?#9.38(VCORE)
NetC?#49_1: C?#49.1 U?#9.37(VCCA)
NetC?#50_2: C?#50.2 R?#9.2 U?#9.34(RESET#)
NetC?#51_1: C?#51.1 U?#9.1(OSCI) X?.2
NetC?#52_2: C?#52.2 U?#9.2(OSCO) X?.1
NetR?#6_1: R?#6.1 U?#9.6(DM)
NetR?#7_1: R?#7.1 U?#9.7(DP)
NetR?#10_2: R?#10.2 U?#9.5(REF)
NetR?#12_1: R?#12.1 R?#14.2 U?#10.1(DO)

Not connected (* = marked no-connect by the designer): L?#3 1 2; U?#9 13(ADBUS0) 14(ADBUS1) 15(ADBUS2) 16(ADBUS3) 17(ADBUS4) 18(ADBUS5) 19(ADBUS6) 20(ADBUS7) 21(ACBUS0) 25(ACBUS1) 26(ACBUS2) 27(ACBUS3) 28(ACBUS4) 29(ACBUS5) 30(ACBUS6) 31(ACBUS7) 32(ACBUS8) 33(ACBUS9)

### Layout directives
differential pair: FTDI_USBData_n, FTDI_USBData_p

### Notes on the sheet
- Following DS_FT232H.pdf Figure 6.2 Self Powered Configuration Example 1.
  Assume a 5V rail is available, but provide a jumper option to power from USB 5V line.
- Give either 5V or 3V3.
- Input if VREGIN = 3V3, ouput if VREGIN = 5V

### Library data of the parts
C?#37 C?#40 C?#41 C?#45 = Cap Pol: Polarized Cap
C?#38 C?#39 C?#42-C?#44 C?#46-C?#50 C?#53 = CMP-1034-02065-1: as C?#3 on sheet FPGA_Misc; Max Thickness: 0.6 mm; Tolerance: ±10%; Rated Voltage: 10 V; Technology: SMT
C?#51 C?#52 = CMP-1034-00944-1: CAP 27pF 10V ±1% 0402 (1005 Metric) Thickness 0.6mm SMD; Case-Metric: 1005; Rated Voltage: 10 V; Max Thickness: 0.6 mm; Technology: SMT
R?#6-R?#8 = CMP-1011-00001-1: as R?#1 on sheet FPGA_Misc; Power: None; Technology: SMT
R?#9 R?#11-R?#13 = CMP-1011-00098-1: 10K 0.063W 5% 0402 (1005 Metric)  SMD; Case-Metric: 1005; Technology: SMT; Power: 0.063 W
R?#10 = CMP-1011-00631-1: 12K 0.063W 1% 0402 (1005 Metric)  SMD; Case-Metric: 1005; Technology: SMT; Power: 0.063 W
R?#14 = CMP-1011-00081-1: 2K 0.063W 5% 0402 (1005 Metric)  SMD; Case-Metric: 1005; Power: 0.063 W; Technology: SMT
U?#9 = FT232HQ-Tray: Single Channel Hi-Speed USB to Multipurpose UART/FIFO IC, 48-pin QFN, Tray; Manufacturer: FTDI; DatasheetVersion: ver 1.8, Dec-2012; PackageVersion: Dec-12; PackageReference: QFN48; PackageDescription: 48-Pin Quad Flat No-Lead 0.5 mm Pitch, 6.2 x 6.2 mm Exposed Pad; PartNumber: FT232HQ-Tray; ComponentLink1Description: Manufacturer URL; ComponentLink1URL: http://www.ftdichip.com/; ComponentLink2Description: Datasheet; ComponentLink2URL: http://www.ftdichip.com/Support/Documents/DataSheets/ICs/DS_FT232H.pdf
U?#10 = 93LC56BT-I/OT: Microchip EEPROM
X? = Crystal: 12MHz Crystal

## Nets that join several sheets
GND: FPGA_Misc (66 pins), DigitalCameraStitcher (5 pins), USB (31 pins)
VCCO_2: FPGA_Misc (11 pins), FPGA_Bank2 (R?#5.2)